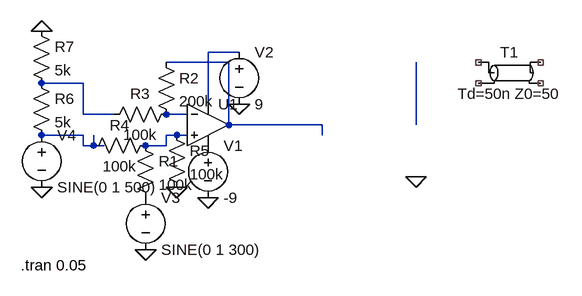
[diagram p0: schematic fullAttenuverter.asc]
fullAttenuverter.asc, the LTspice schematic file:
Version 4
SHEET 1 952 680
WIRE 208 48 160 48
WIRE 192 64 96 64
WIRE -32 96 -96 96
WIRE 160 128 160 48
WIRE -32 144 -32 96
WIRE 16 144 -32 144
WIRE 128 144 96 144
WIRE 192 160 192 64
WIRE 336 160 192 160
WIRE 480 160 480 64
WIRE -32 176 -96 176
WIRE 112 176 96 176
WIRE 128 176 112 176
WIRE 336 176 336 160
WIRE -32 192 -32 176
WIRE -16 192 -16 176
WIRE -16 192 -32 192
WIRE 0 192 -16 192
WIRE 96 192 96 176
WIRE 96 192 64 192
FLAG 160 272 0
FLAG 208 128 0
FLAG -96 256 0
FLAG 64 352 0
FLAG 112 256 0
FLAG -96 16 0
FLAG 480 240 0
SYMBOL Opamps\\UniversalOpamp2 160 160 R0
SYMATTR InstName U1
SYMBOL voltage 160 176 R0
WINDOW 123 0 0 Left 0
WINDOW 39 0 0 Left 0
SYMATTR InstName V1
SYMATTR Value -9
SYMBOL voltage 208 32 R0
WINDOW 123 0 0 Left 0
WINDOW 39 0 0 Left 0
SYMATTR InstName V2
SYMATTR Value 9
SYMBOL voltage 64 256 R0
WINDOW 123 0 0 Left 0
WINDOW 39 0 0 Left 0
SYMATTR InstName V3
SYMATTR Value SINE(0 1 300)
SYMBOL voltage -96 160 R0
WINDOW 123 0 0 Left 0
WINDOW 39 0 0 Left 0
SYMATTR InstName V4
SYMATTR Value SINE(0 1 500)
SYMBOL res 48 176 R0
SYMATTR InstName R1
SYMATTR Value 100k
SYMBOL res 80 48 R0
SYMATTR InstName R2
SYMATTR Value 200k
SYMBOL res 112 128 R90
WINDOW 0 0 56 VBottom 2
WINDOW 3 32 56 VTop 2
SYMATTR InstName R3
SYMATTR Value 100k
SYMBOL res 80 176 R90
WINDOW 0 0 56 VBottom 2
WINDOW 3 32 56 VTop 2
SYMATTR InstName R4
SYMATTR Value 100k
SYMBOL res 96 160 R0
SYMATTR InstName R5
SYMATTR Value 100k
SYMBOL res -112 80 R0
SYMATTR InstName R6
SYMATTR Value 5k
SYMBOL res -112 0 R0
SYMATTR InstName R7
SYMATTR Value 5k
SYMBOL tline 624 80 R0
SYMATTR InstName T1
TEXT -128 376 Left 2 !.tran 0.05

The netlist it stands for:
* fullAttenuverter.asc
XU1 N007 N004 N001 P001 N002 level.2 Avol=1Meg GBW=10Meg Slew=10Meg ilimit=25m rail=0 Vos=0 phimargin=45 en=0 enk=0 in=0 ink=0 Rin=500Meg  ; pins IN+ IN- V+ V- OUT
V1 P001 0 -9
V2 N001 0 9
V3 P002 0 SINE(0 1 300)
V4 N006 0 SINE(0 1 500)
R1 N007 P002 100k
R2 N002 N004 200k
R3 N004 N003 100k
R4 N007 N006 100k
R5 N007 0 100k
R6 N003 N006 5k
R7 0 N003 5k
T1 NC_01 NC_02 NC_03 NC_04 Td=50n Z0=50
.tran 0.05
.lib UniversalOpamps2.sub
.backanno
.end